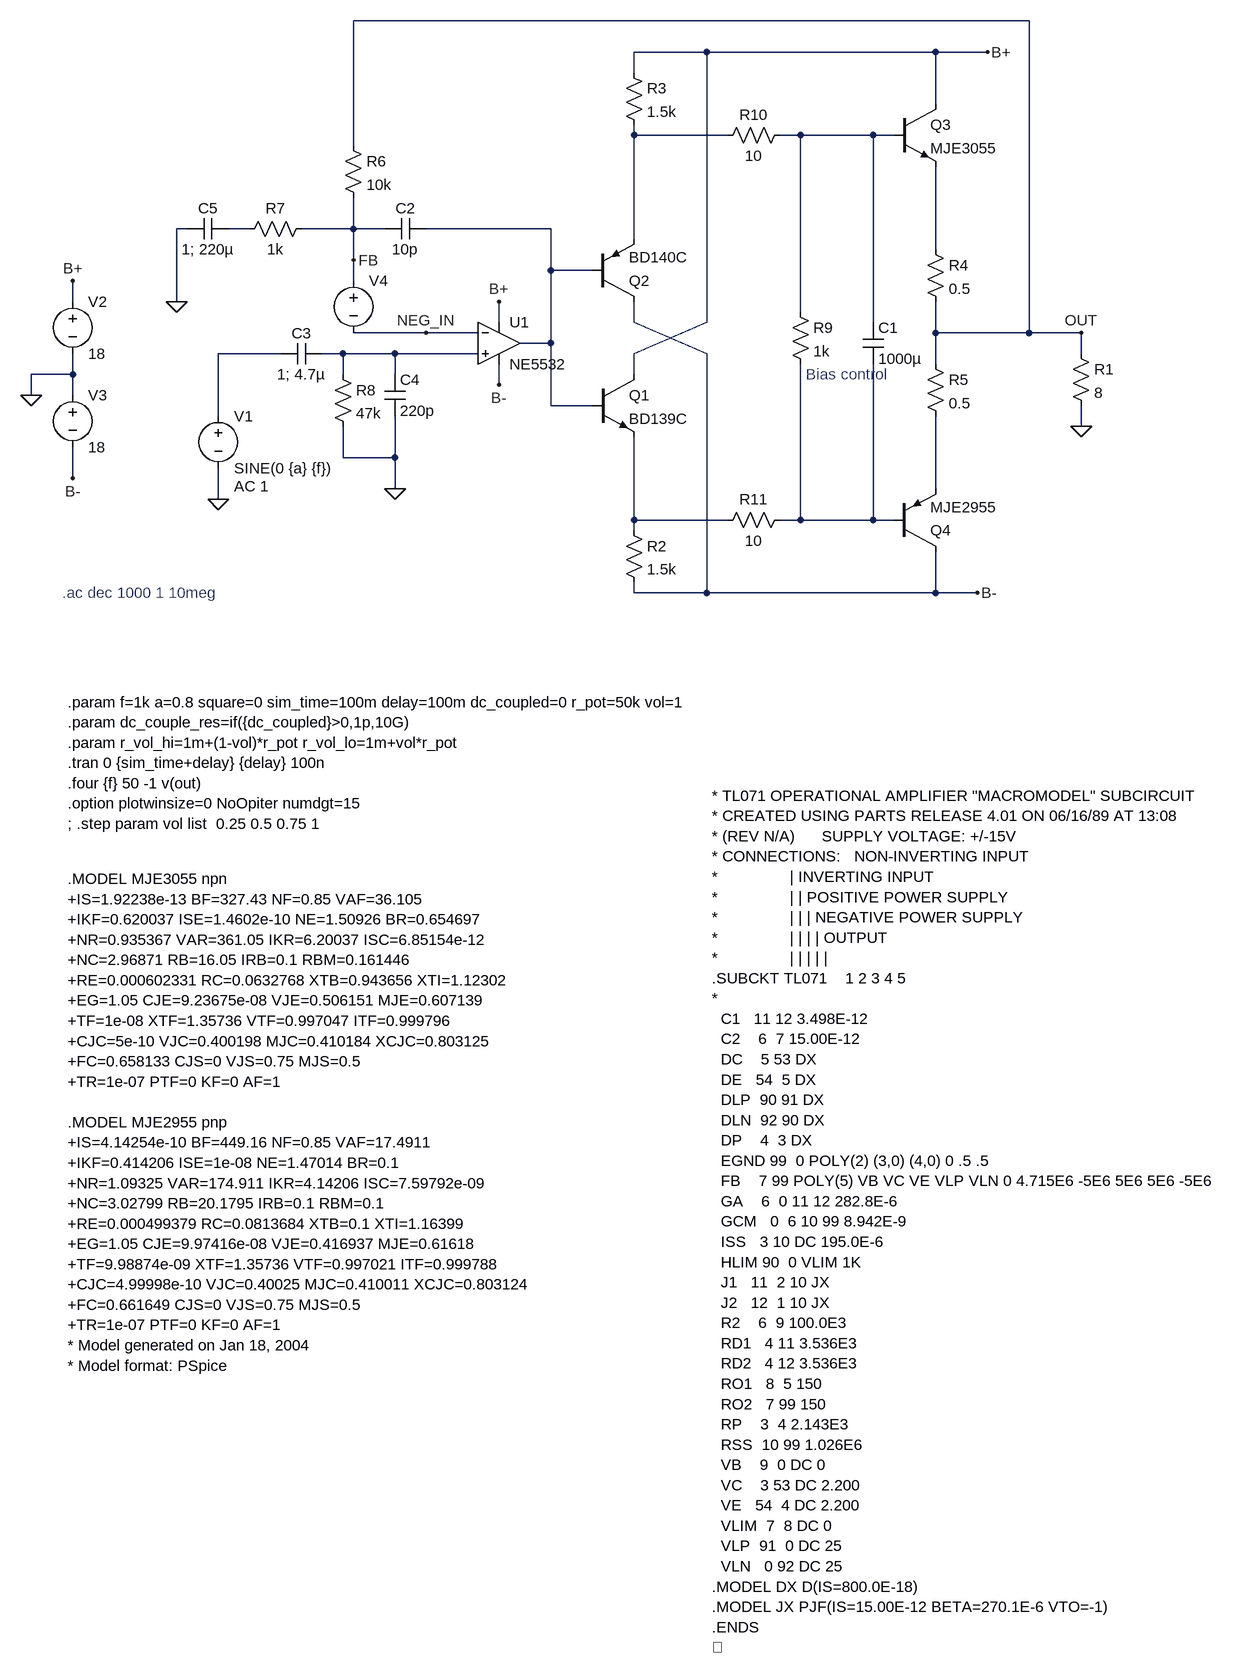
[diagram p0: schematic diamond.asc]
diamond.asc, the LTspice schematic file:
Version 4
SHEET 1 5248 2176
WIRE 1040 -208 0 -208
WIRE 544 -160 432 -160
WIRE 896 -160 544 -160
WIRE 976 -160 896 -160
WIRE 432 -128 432 -160
WIRE 896 -80 896 -160
WIRE 432 -32 432 -48
WIRE 576 -32 432 -32
WIRE 688 -32 656 -32
WIRE 800 -32 688 -32
WIRE 832 -32 800 -32
WIRE 0 -16 0 -208
WIRE -256 112 -272 112
WIRE -160 112 -192 112
WIRE 0 112 0 64
WIRE 0 112 -80 112
WIRE 48 112 0 112
WIRE 304 112 112 112
WIRE 432 128 432 -32
WIRE 896 144 896 16
WIRE 0 160 0 112
WIRE 304 176 304 112
WIRE 368 176 304 176
WIRE 0 192 0 160
WIRE -432 224 -432 192
WIRE -272 224 -272 112
WIRE 688 240 688 -32
WIRE 224 256 224 224
WIRE 432 256 432 224
WIRE 544 256 544 -160
WIRE 800 256 800 -32
WIRE 112 272 0 272
WIRE 192 272 112 272
WIRE 896 272 896 224
WIRE 1040 272 1040 -208
WIRE 1040 272 896 272
WIRE 1120 272 1040 272
WIRE 304 288 304 176
WIRE 304 288 256 288
WIRE -112 304 -208 304
WIRE -16 304 -48 304
WIRE 64 304 -16 304
WIRE 192 304 64 304
WIRE 432 304 544 256
WIRE 544 304 432 256
WIRE 1120 304 1120 272
WIRE 896 320 896 272
WIRE -432 336 -432 304
WIRE -432 336 -496 336
WIRE -16 336 -16 304
WIRE 64 336 64 304
WIRE 432 336 432 304
WIRE 224 352 224 320
WIRE -496 368 -496 336
WIRE -432 368 -432 336
WIRE 304 384 304 288
WIRE 368 384 304 384
WIRE -208 400 -208 304
WIRE 1120 416 1120 384
WIRE -16 464 -16 416
WIRE 64 464 64 400
WIRE 64 464 -16 464
WIRE -432 496 -432 448
WIRE 64 512 64 464
WIRE 896 512 896 400
WIRE -208 528 -208 480
WIRE 432 560 432 432
WIRE 576 560 432 560
WIRE 688 560 688 320
WIRE 688 560 656 560
WIRE 800 560 800 320
WIRE 800 560 688 560
WIRE 832 560 800 560
WIRE 432 576 432 560
WIRE 432 672 432 656
WIRE 544 672 544 304
WIRE 544 672 432 672
WIRE 896 672 896 608
WIRE 896 672 544 672
WIRE 960 672 896 672
FLAG -208 528 0
FLAG 1120 416 0
FLAG 960 672 B-
FLAG 976 -160 B+
FLAG -432 192 B+
FLAG -496 368 0
FLAG -432 496 B-
FLAG 1120 272 OUT
FLAG 224 224 B+
FLAG 224 352 B-
FLAG 64 512 0
FLAG -272 224 0
FLAG 0 160 FB
FLAG 112 272 NEG_IN
SYMBOL npn 368 336 R0
SYMATTR InstName Q1
SYMATTR Value BD139C
SYMBOL pnp 368 224 M180
SYMATTR InstName Q2
SYMATTR Value BD140C
SYMBOL voltage -208 384 R0
WINDOW 123 24 124 Left 2
WINDOW 39 0 0 Left 0
SYMATTR Value2 AC 1
SYMATTR InstName V1
SYMATTR Value SINE(0 {a} {f})
SYMBOL npn 832 -80 R0
SYMATTR InstName Q3
SYMATTR Value MJE3055
SYMBOL pnp 832 608 M180
SYMATTR InstName Q4
SYMATTR Value MJE2955
SYMBOL res 1104 288 R0
SYMATTR InstName R1
SYMATTR Value 8
SYMBOL voltage -432 208 R0
WINDOW 123 0 0 Left 0
WINDOW 39 0 0 Left 0
SYMATTR InstName V2
SYMATTR Value 18
SYMBOL voltage -432 352 R0
WINDOW 123 0 0 Left 0
WINDOW 39 0 0 Left 0
SYMATTR InstName V3
SYMATTR Value 18
SYMBOL res 880 128 R0
SYMATTR InstName R4
SYMATTR Value 0.5
SYMBOL res 880 304 R0
SYMATTR InstName R5
SYMATTR Value 0.5
SYMBOL OpAmps\\NE5532 224 288 R0
SYMATTR InstName U1
SYMBOL res -16 -32 R0
SYMATTR InstName R6
SYMATTR Value 10k
SYMBOL res -64 96 R90
WINDOW 0 0 56 VBottom 2
WINDOW 3 32 56 VTop 2
SYMATTR InstName R7
SYMATTR Value 1k
SYMBOL cap -48 288 R90
WINDOW 0 0 32 VBottom 2
WINDOW 3 32 32 VTop 2
SYMATTR InstName C3
SYMATTR Value 1; 4.7µ
SYMBOL res -32 320 R0
SYMATTR InstName R8
SYMATTR Value 47k
SYMBOL cap 48 336 R0
SYMATTR InstName C4
SYMATTR Value 220p
SYMBOL cap -192 96 R90
WINDOW 0 0 32 VBottom 2
WINDOW 3 32 32 VTop 2
SYMATTR InstName C5
SYMATTR Value 1; 220µ
SYMBOL voltage 0 176 R0
WINDOW 123 24 124 Left 2
WINDOW 39 0 0 Left 0
SYMATTR InstName V4
SYMATTR Value ""
SYMBOL cap 112 96 R90
WINDOW 0 0 32 VBottom 2
WINDOW 3 32 32 VTop 2
SYMATTR InstName C2
SYMATTR Value 10p
SYMBOL res 416 560 R0
SYMATTR InstName R2
SYMATTR Value 1.5k
SYMBOL res 416 -144 R0
SYMATTR InstName R3
SYMATTR Value 1.5k
SYMBOL res 672 -48 R90
WINDOW 0 0 56 VBottom 2
WINDOW 3 32 56 VTop 2
SYMATTR InstName R10
SYMATTR Value 10
SYMBOL res 672 544 R90
WINDOW 0 0 56 VBottom 2
WINDOW 3 32 56 VTop 2
SYMATTR InstName R11
SYMATTR Value 10
SYMBOL res 672 224 R0
SYMATTR InstName R9
SYMATTR Value 1k
SYMBOL cap 784 256 R0
SYMATTR InstName C1
SYMATTR Value 1000µ
TEXT -448 672 Left 2 ;.ac dec 1000 1 10meg
TEXT -440 840 Left 2 !.param f=1k a=0.8 square=0 sim_time=100m delay=100m dc_coupled=0 r_pot=50k vol=1\n.param dc_couple_res=if({dc_coupled}>0,1p,10G)\n.param r_vol_hi=1m+(1-vol)*r_pot r_vol_lo=1m+vol*r_pot\n.tran 0 {sim_time+delay} {delay} 100n\n.four {f} 50 -1 v(out)\n.option plotwinsize=0 NoOpiter numdgt=15\n; .step param vol list  0.25 0.5 0.75 1
TEXT -440 1112 Left 2 !.MODEL MJE3055 npn\n+IS=1.92238e-13 BF=327.43 NF=0.85 VAF=36.105\n+IKF=0.620037 ISE=1.4602e-10 NE=1.50926 BR=0.654697\n+NR=0.935367 VAR=361.05 IKR=6.20037 ISC=6.85154e-12\n+NC=2.96871 RB=16.05 IRB=0.1 RBM=0.161446\n+RE=0.000602331 RC=0.0632768 XTB=0.943656 XTI=1.12302\n+EG=1.05 CJE=9.23675e-08 VJE=0.506151 MJE=0.607139\n+TF=1e-08 XTF=1.35736 VTF=0.997047 ITF=0.999796\n+CJC=5e-10 VJC=0.400198 MJC=0.410184 XCJC=0.803125\n+FC=0.658133 CJS=0 VJS=0.75 MJS=0.5\n+TR=1e-07 PTF=0 KF=0 AF=1\n \n.MODEL MJE2955 pnp\n+IS=4.14254e-10 BF=449.16 NF=0.85 VAF=17.4911\n+IKF=0.414206 ISE=1e-08 NE=1.47014 BR=0.1\n+NR=1.09325 VAR=174.911 IKR=4.14206 ISC=7.59792e-09\n+NC=3.02799 RB=20.1795 IRB=0.1 RBM=0.1\n+RE=0.000499379 RC=0.0813684 XTB=0.1 XTI=1.16399\n+EG=1.05 CJE=9.97416e-08 VJE=0.416937 MJE=0.61618\n+TF=9.98874e-09 XTF=1.35736 VTF=0.997021 ITF=0.999788\n+CJC=4.99998e-10 VJC=0.40025 MJC=0.410011 XCJC=0.803124\n+FC=0.661649 CJS=0 VJS=0.75 MJS=0.5\n+TR=1e-07 PTF=0 KF=0 AF=1\n* Model generated on Jan 18, 2004\n* Model format: PSpice
TEXT 696 336 Left 2 ;Bias control
TEXT 552 984 Left 2 !* TL071 OPERATIONAL AMPLIFIER "MACROMODEL" SUBCIRCUIT\n* CREATED USING PARTS RELEASE 4.01 ON 06/16/89 AT 13:08\n* (REV N/A)      SUPPLY VOLTAGE: +/-15V\n* CONNECTIONS:   NON-INVERTING INPUT\n*                | INVERTING INPUT\n*                | | POSITIVE POWER SUPPLY\n*                | | | NEGATIVE POWER SUPPLY\n*                | | | | OUTPUT\n*                | | | | |\n.SUBCKT TL071    1 2 3 4 5\n*\n  C1   11 12 3.498E-12\n  C2    6  7 15.00E-12\n  DC    5 53 DX\n  DE   54  5 DX\n  DLP  90 91 DX\n  DLN  92 90 DX\n  DP    4  3 DX\n  EGND 99  0 POLY(2) (3,0) (4,0) 0 .5 .5\n  FB    7 99 POLY(5) VB VC VE VLP VLN 0 4.715E6 -5E6 5E6 5E6 -5E6\n  GA    6  0 11 12 282.8E-6\n  GCM   0  6 10 99 8.942E-9\n  ISS   3 10 DC 195.0E-6\n  HLIM 90  0 VLIM 1K\n  J1   11  2 10 JX\n  J2   12  1 10 JX\n  R2    6  9 100.0E3\n  RD1   4 11 3.536E3\n  RD2   4 12 3.536E3\n  RO1   8  5 150\n  RO2   7 99 150\n  RP    3  4 2.143E3\n  RSS  10 99 1.026E6\n  VB    9  0 DC 0\n  VC    3 53 DC 2.200\n  VE   54  4 DC 2.200\n  VLIM  7  8 DC 0\n  VLP  91  0 DC 25\n  VLN   0 92 DC 25\n.MODEL DX D(IS=800.0E-18)\n.MODEL JX PJF(IS=15.00E-12 BETA=270.1E-6 VTO=-1)\n.ENDS\n

The netlist it stands for:
* diamond.asc
Q1 B+ N004 N009 0 BD139C
Q2 B- N004 N001 0 BD140C
V1 N006 0 SINE(0 {a} {f}) AC 1
Q3 B+ N002 N005 0 MJE3055
Q4 B- N010 N008 0 MJE2955
R1 OUT 0 8
V2 B+ 0 18
V3 0 B- 18
R4 N005 OUT 0.5
R5 OUT N008 0.5
* U1: NE5532 (symbol OpAmps\NE5532 not available, pins judged from their places): In+=N007 In-=NEG_IN V+=B+ V-=B- OUT=N004
R6 OUT FB 10k
R7 FB N003 1k
C3 N007 N006 1; 4.7µ
R8 N007 0 47k
C4 N007 0 220p
C5 N003 0 1; 220µ
V4 FB NEG_IN
C2 N004 FB 10p
R2 N009 B- 1.5k
R3 B+ N001 1.5k
R10 N002 N001 10
R11 N010 N009 10
R9 N002 N010 1k
C1 N002 N010 1000µ
.model NPN NPN
.model PNP PNP
.lib standard.bjt
* .ac dec 1000 1 10meg
.param f=1k a=0.8 square=0 sim_time=100m delay=100m dc_coupled=0 r_pot=50k vol=1
.param dc_couple_res=if({dc_coupled}>0,1p,10G)
.param r_vol_hi=1m+(1-vol)*r_pot r_vol_lo=1m+vol*r_pot
.tran 0 {sim_time+delay} {delay} 100n
.four {f} 50 -1 v(out)
.option plotwinsize=0 NoOpiter numdgt=15
; .step param vol list  0.25 0.5 0.75 1
.MODEL MJE3055 npn
+IS=1.92238e-13 BF=327.43 NF=0.85 VAF=36.105
+IKF=0.620037 ISE=1.4602e-10 NE=1.50926 BR=0.654697
+NR=0.935367 VAR=361.05 IKR=6.20037 ISC=6.85154e-12
+NC=2.96871 RB=16.05 IRB=0.1 RBM=0.161446
+RE=0.000602331 RC=0.0632768 XTB=0.943656 XTI=1.12302
+EG=1.05 CJE=9.23675e-08 VJE=0.506151 MJE=0.607139
+TF=1e-08 XTF=1.35736 VTF=0.997047 ITF=0.999796
+CJC=5e-10 VJC=0.400198 MJC=0.410184 XCJC=0.803125
+FC=0.658133 CJS=0 VJS=0.75 MJS=0.5
+TR=1e-07 PTF=0 KF=0 AF=1
.MODEL MJE2955 pnp
+IS=4.14254e-10 BF=449.16 NF=0.85 VAF=17.4911
+IKF=0.414206 ISE=1e-08 NE=1.47014 BR=0.1
+NR=1.09325 VAR=174.911 IKR=4.14206 ISC=7.59792e-09
+NC=3.02799 RB=20.1795 IRB=0.1 RBM=0.1
+RE=0.000499379 RC=0.0813684 XTB=0.1 XTI=1.16399
+EG=1.05 CJE=9.97416e-08 VJE=0.416937 MJE=0.61618
+TF=9.98874e-09 XTF=1.35736 VTF=0.997021 ITF=0.999788
+CJC=4.99998e-10 VJC=0.40025 MJC=0.410011 XCJC=0.803124
+FC=0.661649 CJS=0 VJS=0.75 MJS=0.5
+TR=1e-07 PTF=0 KF=0 AF=1
* Model generated on Jan 18, 2004
* Model format: PSpice
* Bias control
* TL071 OPERATIONAL AMPLIFIER "MACROMODEL" SUBCIRCUIT
* CREATED USING PARTS RELEASE 4.01 ON 06/16/89 AT 13:08
* (REV N/A)      SUPPLY VOLTAGE: +/-15V
* CONNECTIONS:   NON-INVERTING INPUT
*                | INVERTING INPUT
*                | | POSITIVE POWER SUPPLY
*                | | | NEGATIVE POWER SUPPLY
*                | | | | OUTPUT
*                | | | | |
.SUBCKT TL071    1 2 3 4 5
*
  C1   11 12 3.498E-12
  C2    6  7 15.00E-12
  DC    5 53 DX
  DE   54  5 DX
  DLP  90 91 DX
  DLN  92 90 DX
  DP    4  3 DX
  EGND 99  0 POLY(2) (3,0) (4,0) 0 .5 .5
  FB    7 99 POLY(5) VB VC VE VLP VLN 0 4.715E6 -5E6 5E6 5E6 -5E6
  GA    6  0 11 12 282.8E-6
  GCM   0  6 10 99 8.942E-9
  ISS   3 10 DC 195.0E-6
  HLIM 90  0 VLIM 1K
  J1   11  2 10 JX
  J2   12  1 10 JX
  R2    6  9 100.0E3
  RD1   4 11 3.536E3
  RD2   4 12 3.536E3
  RO1   8  5 150
  RO2   7 99 150
  RP    3  4 2.143E3
  RSS  10 99 1.026E6
  VB    9  0 DC 0
  VC    3 53 DC 2.200
  VE   54  4 DC 2.200
  VLIM  7  8 DC 0
  VLP  91  0 DC 25
  VLN   0 92 DC 25
.MODEL DX D(IS=800.0E-18)
.MODEL JX PJF(IS=15.00E-12 BETA=270.1E-6 VTO=-1)
.ENDS

.backanno
.end